# EAGLE design Raspberry-Board (EAGLE 6.4)
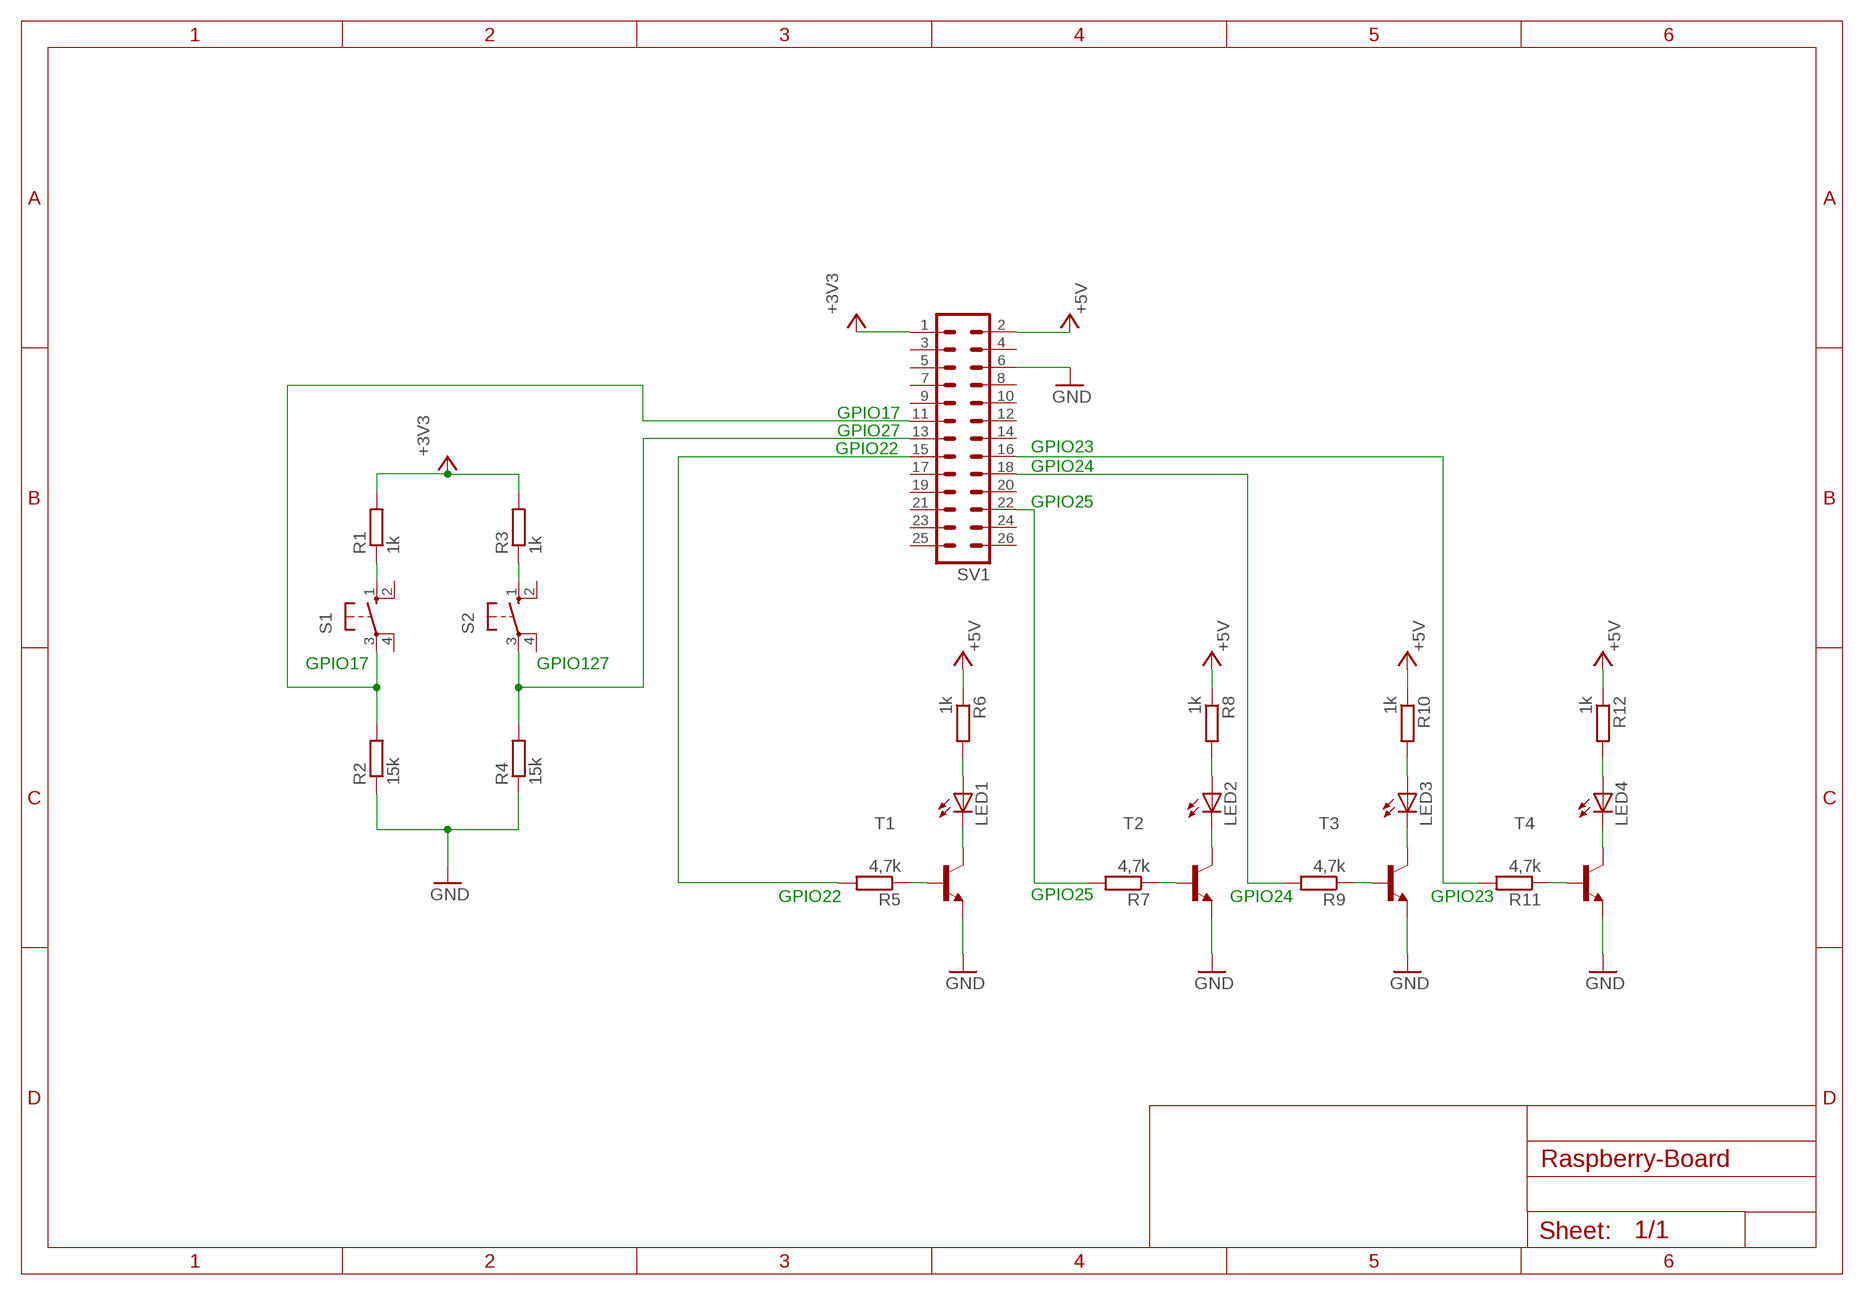
[diagram p0: schematic, sheet 1]

## Parts
LED1  LEDCHIPLED_1206  [CHIPLED_1206]
LED2  LEDCHIPLED_1206  [CHIPLED_1206]
LED3  LEDCHIPLED_1206  [CHIPLED_1206]
LED4  LEDCHIPLED_1206  [CHIPLED_1206]
R1  1k  R-EU_R0805  [R0805]
R2  15k  R-EU_R0805  [R0805]
R3  1k  R-EU_R0805  [R0805]
R4  15k  R-EU_R0805  [R0805]
R5  4,7k  R-EU_R0805  [R0805]
R6  1k  R-EU_R0805  [R0805]
R7  4,7k  R-EU_R0805  [R0805]
R8  1k  R-EU_R0805  [R0805]
R9  4,7k  R-EU_R0805  [R0805]
R10  1k  R-EU_R0805  [R0805]
R11  4,7k  R-EU_R0805  [R0805]
R12  1k  R-EU_R0805  [R0805]
S1  10-XX  [B3F-10XX]
S2  10-XX  [B3F-10XX]
SV1  MA13-2  [MA13-2]
T1  BC817-16-NPN-SOT23-BEC  [SOT23-BEC]
T2  BC817-16-NPN-SOT23-BEC  [SOT23-BEC]
T3  BC817-16-NPN-SOT23-BEC  [SOT23-BEC]
T4  BC817-16-NPN-SOT23-BEC  [SOT23-BEC]

## Nets
+3V3: R1.2 R3.2 SV1.1
+5V: R6.1 R8.1 R10.1 R12.1 SV1.2
GND: R2.1 R4.1 SV1.6 T1.E T2.E T3.E T4.E
N$1: R1.1 S1.1(S)
N$2: R3.1 S2.1(S)
N$3: R2.2 S1.3(P) SV1.11
N$4: R4.2 S2.3(P) SV1.13
N$5: LED1.A R6.2
N$6: LED1.C T1.C
N$7: R5.1 T1.B
N$8: R5.2 SV1.15
N$9: LED2.A R8.2
N$10: LED2.C T2.C
N$11: R7.1 T2.B
N$12: LED3.A R10.2
N$13: LED3.C T3.C
N$14: R9.1 T3.B
N$15: R7.2 SV1.22
N$16: LED4.A R12.2
N$17: LED4.C T4.C
N$18: R11.1 T4.B
N$19: R9.2 SV1.18
N$20: R11.2 SV1.16
Unconnected: S1.2(S1) S1.4(P1) S2.2(S1) S2.4(P1) SV1.3 SV1.4 SV1.5 SV1.7 SV1.8 SV1.9 SV1.10 SV1.12 SV1.14 SV1.17 SV1.19 SV1.20 SV1.21 SV1.23 SV1.24 SV1.25 SV1.26

## Notes on the sheet
- GPIO17
- GPIO27
- GPIO22 | GPIO23
- GPIO24
- GPIO25
- GPIO17 | GPIO127
- GPIO22 | GPIO25 | GPIO24 | GPIO23

## Library data of the parts
LED1-LED4 = led:LED: LED OSRAM: - CHIPLED LG R971, LG N971, LY N971, LG Q971, LY Q971, LO R971, LY R971 LH N974, LH R974 LS Q976, LO Q976, LY Q976 LO Q996 - Hyper CHIPLED LW Q18S LB Q993, LB Q99A, LB R99A - SideLED LS A670, LO A670, LY A670, LG A670, LP A670 LB A673, LV A673, LT A673, LW A673 LH A674 LY A675 LS A676, LA A676, LO A676, LY A676, LW A676 LS A679, LY A679, LG A679 - Hyper Micro SIDELED® LS Y876, LA Y876, LO Y876, LY Y876 LT Y87S - SmartLED LW L88C, LW L88S LB L89C, LB L89S, LG L890 LS L89K, LO L89K, LY L89K LS L896, LA L896, LO L896, LY L896 - TOPLED LS T670, LO T670, LY T670, LG T670, LP T670 LSG T670, LSP T670, LSY T670, LOP T670, LYG T670 LG T671, LOG T671, LSG T671 LB T673, LV T673, LT T673, LW T673 LH T674 LS T676, LA T676, LO T676, LY T676, LB T676, LH T676, LSB T676, LW T676 LB T67C, LV T67C, LT T67C, LS T67K, LO T67K, LY T67K, LW E67C LS E67B, LA E67B, LO E67B, LY E67B, LB E67C, LV E67C, LT E67C LW T67C LS T679, LY T679, LG T679 LS T770, LO T770, LY T770, LG T770, LP T770 LB T773, LV T773, LT T773, LW T773 LH T774 LS E675, LA E675, LY E675, LS T675 LS T776, LA T776, LO T776, LY T776, LB T776 LHGB T686 LT T68C, LB T68C - Hyper Mini TOPLED® LB M676 - Mini TOPLED Santana® LG M470 LS M47K, LO M47K, LY M47K Source: http://www.osram.convergy.de LUXEON: - LUMILED® LXK2-PW12-R00, LXK2-PW12-S00, LXK2-PW14-U00, LXK2-PW14-V00 LXK2-PM12-R00, LXK2-PM12-S00, LXK2-PM14-U00 LXK2-PE12-Q00, LXK2-PE12-R00, LXK2-PE12-S00, LXK2-PE14-T00, LXK2-PE14-U00 LXK2-PB12-K00, LXK2-PB12-L00, LXK2-PB12-M00, LXK2-PB14-N00, LXK2-PB14-P00, LXK2-PB14-Q00 LXK2-PR12-L00, LXK2-PR12-M00, LXK2-PR14-Q00, LXK2-PR14-R00 LXK2-PD12-Q00, LXK2-PD12-R00, LXK2-PD12-S00 LXK2-PH12-R00, LXK2-PH12-S00 LXK2-PL12-P00, LXK2-PL12-Q00, LXK2-PL12-R00 Source: www.luxeon.com KINGBRIGHT: KA-3528ASYC Source: www.kingbright.com
R1-R12 = rcl:R-EU_: RESISTOR, European symbol
S1 S2 = switch-omron:10-XX: OMRON SWITCH; MPN: B3F-1000; OC_FARNELL: 176432; OC_NEWARK: 36M3542
SV1 = con-lstb:MA13-2: PIN HEADER; OC_FARNELL: unknown; OC_NEWARK: unknown
T1-T4 = transistor:*-NPN-: NPN Transistror BF959 corrected 2008.03.06

## Board
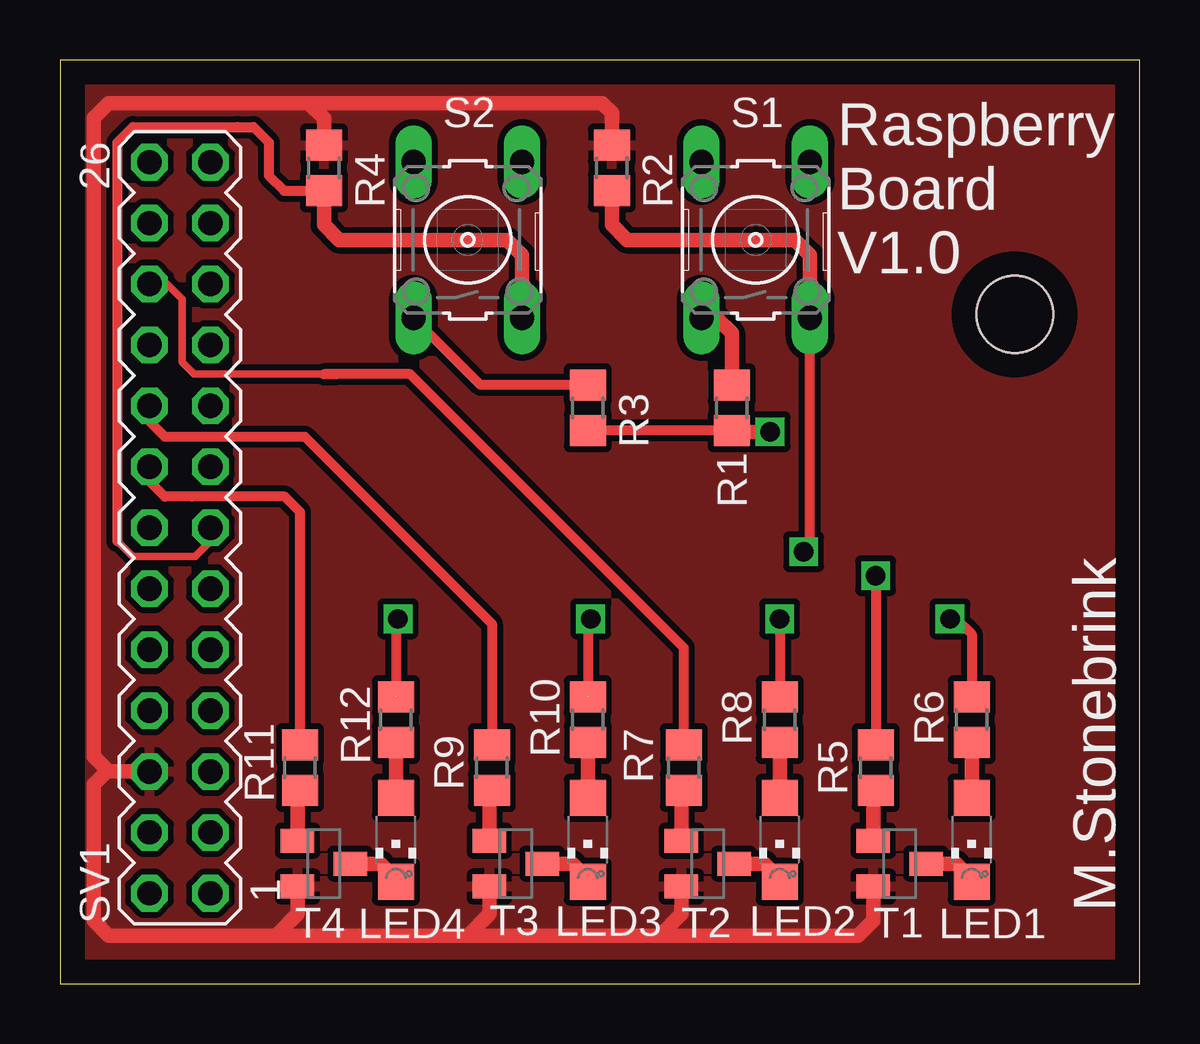
[diagram p1: board, top side]
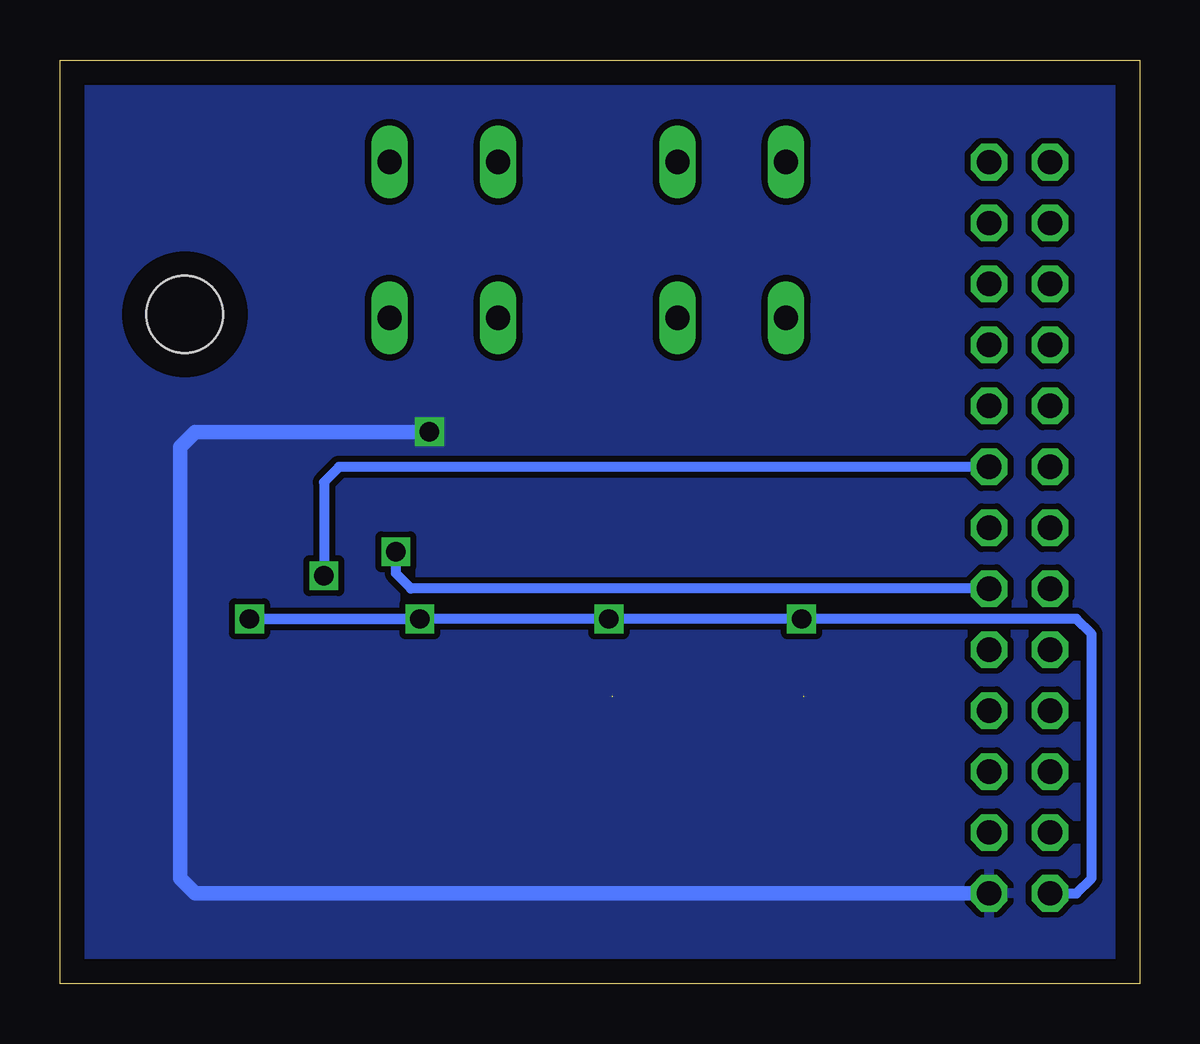
[diagram p2: board, bottom side, seen from below]

Size 45 x 38.5 mm. Coordinates in mm from the lower left corner, seen from the top.
Outline: 0,0 45,0 45,38.5 0,38.5 0,0
Copper layers (1*16): Top 0.035mm / dielectric 1.5mm / Bottom 0.035mm
Design rules "Bilex DRU": minimum track width 10mil, minimum drill 24mil, track to track 10mil, track to pad 10mil, pad to pad 10mil, via to via 10mil, smd to smd 10mil, copper to edge 40mil, drill to drill 8mil, minimum pad ring 10mil, minimum via ring 8mil, stop-mask expansion 4mil, vias tented up to drill 0mil, thermal gap 10mil
Holes 3.2 mm at 39.8,27.9

### Footprints (pad centres in the part's own frame; a part is rotated, then mirrored left to right if it is on the bottom)
CHIPLED_1206 = smd 1.5 x 1.5: A 0,-1.75; C 0,1.75
R0805 = smd 1.3 x 1.5: 1 -0.95,0; 2 0.95,0
B3F-10XX = drill 1.016 long: 1 -3.251,2.261; 2 3.251,2.261; 3 -3.251,-2.261; 4 3.251,-2.261
MA13-2 = drill 1.016 octagon: 1 -15.24,-1.27; 2 -15.24,1.27; 3 -12.7,-1.27; 4 -12.7,1.27; 5 -10.16,-1.27; 6 -10.16,1.27; 7 -7.62,-1.27; 8 -7.62,1.27; 9 -5.08,-1.27; 10 -5.08,1.27; 11 -2.54,-1.27; 12 -2.54,1.27; 13 0,-1.27; 14 0,1.27; 15 2.54,-1.27; 16 2.54,1.27; 17 5.08,-1.27; 18 5.08,1.27; 19 7.62,-1.27; 20 7.62,1.27; 21 10.16,-1.27; 22 10.16,1.27; 23 12.7,-1.27; 24 12.7,1.27; 25 15.24,-1.27; 26 15.24,1.27
SOT23-BEC = smd 1 x 1.4: B -0.95,-1.1; C 0,1.1; E 0.95,-1.1

### Placement (x,y rotation side)
LED1  38,6 180 top
LED2  30,6 180 top
LED3  22,6 180 top
LED4  14,6 180 top
R1  28,24 270 top
R2  23,34 270 top
R3  22,24 270 top
R4  11,34 270 top
R5  34,9 90 top
R6  38,11 270 top
R7  26,9 90 top
R8  30,11 270 top
R9  18,9 90 top
R10  22,11 270 top
R11  10,9 90 top
R12  14,11 270 top
S1  29,31 90 top
S2  17,31 90 top
SV1  5,19 90 top
T1  35,5 270 top
T2  27,5 270 top
T3  19,5 270 top
T4  11,5 270 top

### Tracks (layer width: path | path; a pad name or v marks a point on that pad's centre or on a via)
+3V3  (via drill 0.8)
  Top 0.406: R1.2 R3.2
  Top 0.61: R1.2 28.05,23 v29.6,23
  Bottom 0.61: SV1.1 39.37,3.76 40,4.39 40,19 40,22.36 39.37,23 32,23 | 32,23 v29.6,23 32,23
  pour Bottom: 0,38 0,1 44.37,1 45,1.64 45,38
+5V  (via drill 0.8)  (2 unrouted)
  Top 0.406: v37.1,15.2 37.37,15.2 38,14.56 R6.1 | v30,15.2 R8.1 | v22.12,15.2 22,15.08 22,12 | v14.09,15.2 14,15.12 14,12
  Bottom 0.406: SV1.2 2.63,3.76 2,4.39 2,10 2,14.56 2.63,15.2 8.9,15.2 v14.09,15.2 v22.12,15.2 v30,15.2 | v30,15.2 v37.1,15.2 v30,15.2
GND
  Top 0.61: T1.E 33.9,2.63 33.27,2 25,2 | 25,2 17,2 | 17,2 9,2 | 9,2 5,2 2.04,2 1.4,2.63 1.4,8.3 1.94,8.84 SV1.6 2.04,8.84 1.4,9.47 1.4,34.5 1.4,36.06 2.04,36.7 10,36.7 | T4.E 9.9,2.9 9,2 | T3.E 17.9,2.9 17,2 | T2.E 25.9,2.9 25,2 | 10,36.7 22.6,36.7 23,36.3 R2.1 | R4.1 11,36.06 10.37,36.7 10,36.7
  pour Top: 0,38 44.37,38 45,37.37 45,1 0.64,1 0,1.64
N$1
  Top 0.61: S1.1 27.36,27.75 28,27.11 R1.1
N$2
  Top 0.406: R3.1 17.54,24.95 S2.1
N$3  (via drill 0.8)
  Top 0.406: v31,18 31.26,18.26 S1.3
  Top 0.61: R2.2 23,31.64 23.64,31 29,31 30.63,31 31.26,30.36 S1.3
  Bottom 0.406: SV1.11 30.36,16.46 31,17.09 v31,18
N$4
  Top 0.305: 6.27,18.43 5.63,17.8 3.7,17.8 3.04,17.8 2.4,18.43
  Top 0.406: SV1.13 6.27,18.43 | 2.4,18.43 2.4,29.2 2.4,35.06 3.04,35.7 7.4,35.7 8.06,35.7 8.7,35.06 8.7,34.2 8.7,33.69 9.34,33.05 R4.2
  Top 0.61: R4.2 11,31.64 11.63,31 17,31 18.63,31 19.26,30.36 S2.3
N$5
  Top 0.61: LED1.A R6.2
N$6
  Top 0.61: LED1.C 38,4.37 37.37,5 T1.C
N$7
  Top 0.61: T1.B 33.9,7.95 R5.1
N$8  (via drill 0.8)
  Top 0.406: v34,17 R5.2
  Bottom 0.406: SV1.15 33.37,21.54 34,20.91 v34,17
N$9
  Top 0.61: LED2.A R8.2
N$10
  Top 0.61: LED2.C 30,4.37 29.36,5 T2.C
N$11
  Top 0.61: T2.B 25.9,7.95 R7.1
N$12
  Top 0.61: LED3.A R10.2
N$13
  Top 0.61: LED3.C 22,4.37 21.36,5 T3.C
N$14
  Top 0.61: T3.B 17.9,7.95 R9.1
N$15
  Top 0.305: SV1.22 4.46,29.16 5.1,28.52 5.1,25.9 5.6,25.4 11,25.4
  Top 0.406: 11.5,25.4 11,25.4 14.6,25.4 15,25 26,14 26,10 R7.2
N$16
  Top 0.61: LED4.A R12.2
N$17
  Top 0.61: LED4.C 14,4.37 13.37,5 T4.C
N$18
  Top 0.61: T4.B 9.9,7.95 R11.1
N$19
  Top 0.406: SV1.18 3.73,23.43 4.37,22.8 7.7,22.8 10.2,22.8 18,15 R9.2
N$20
  Top 0.406: R11.2 10,18 10,19.66 9.37,20.3 5.5,20.3 4.37,20.3 3.73,20.93 SV1.16

### Text on the board
tNames: Raspberry / Board / V1.0 | M.Stonebrink